# Altium schematic sheet [03]Breakout Headers.SchDoc
size A4; Organization: Altium Limited; Address1: L3, 12a Rodborough Rd; Address2: Frenchs Forest; Address3: NSW; Address4: Australia 2086
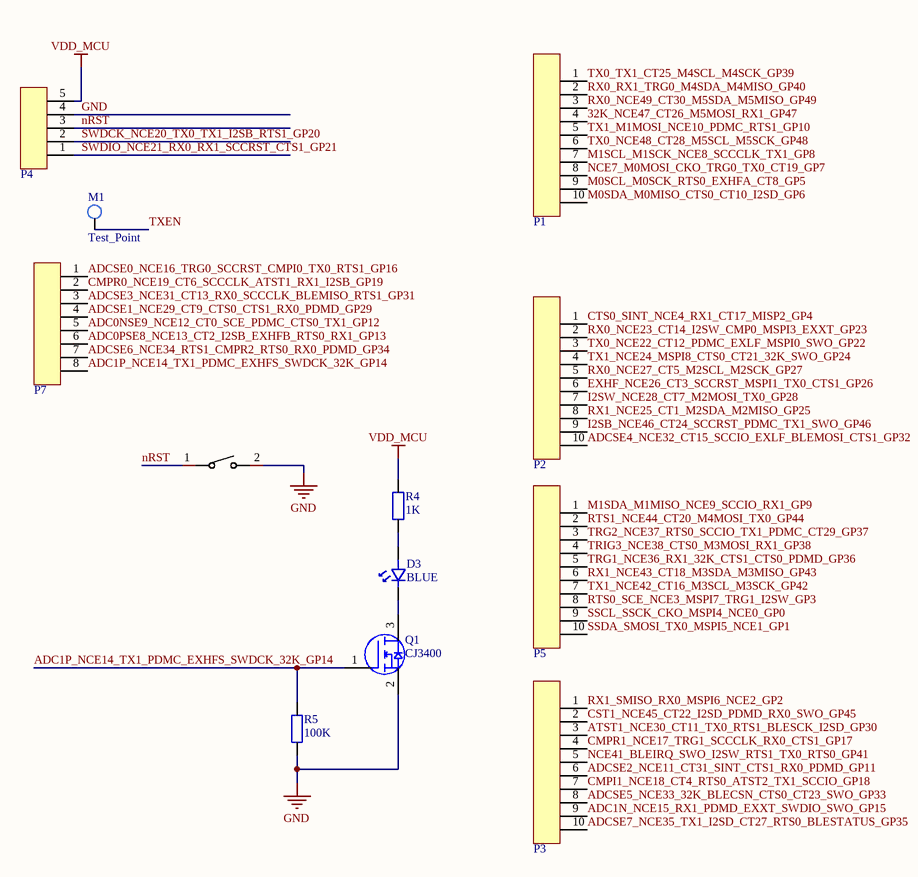
[diagram p0: [03]Breakout Headers.SchDoc]

## Parts
D3  BLUE  [LEDC1608L]
M1  Test_Point  [MARK_Small]
P1  Header 1X10  [HEADER1X10]  (value not drawn)  (no BOM)
P2  Header 1X10  [HEADER1X10]  (value not drawn)  (no BOM)
P3  Header 1X10  [HEADER1X10]  (value not drawn)  (no BOM)
P4  Header 1X8  [HEADER1X5]  (value not drawn)  (no BOM)
P5  Header 1X10  [HEADER1X10]  (value not drawn)  (no BOM)
P7  Header 1X8  [HEADER1X8]  (value not drawn)  (no BOM)
Q1  CJ3400  [SOT23-3L]
R4  1K  [RESC1005L]
R5  100K  [RESC1005L]
SW1  TS-1088-AR02016  [SW-SMD_L4.0-W2.9-LS5.0]  (value not drawn)

## Nets
GND: P4.4 Q1.2 R5.1 SW1.2
VDD_MCU: P4.5 R4.2
32K_NCE47_CT26_M5MOSI_RX1_GP47: P1.4
ADC0NSE9_NCE12_CT0_SCE_PDMC_CTS0_TX1_GP12: P7.5
ADC0PSE8_NCE13_CT2_I2SB_EXHFB_RTS0_RX1_GP13: P7.6
ADC1N_NCE15_RX1_PDMD_EXXT_SWDIO_SWO_GP15: P3.9
ADC1P_NCE14_TX1_PDMC_EXHFS_SWDCK_32K_GP14: P7.8 Q1.1 R5.2
ADCSE0_NCE16_TRG0_SCCRST_CMPI0_TX0_RTS1_GP16: P7.1
ADCSE1_NCE29_CT9_CTS0_CTS1_RX0_PDMD_GP29: P7.4
ADCSE2_NCE11_CT31_SINT_CTS1_RX0_PDMD_GP11: P3.6
ADCSE3_NCE31_CT13_RX0_SCCCLK_BLEMISO_RTS1_GP31: P7.3
ADCSE4_NCE32_CT15_SCCIO_EXLF_BLEMOSI_CTS1_GP32: P2.10
ADCSE5_NCE33_32K_BLECSN_CTS0_CT23_SWO_GP33: P3.8
ADCSE6_NCE34_RTS1_CMPR2_RTS0_RX0_PDMD_GP34: P7.7
ADCSE7_NCE35_TX1_I2SD_CT27_RTS0_BLESTATUS_GP35: P3.10
ATST1_NCE30_CT11_TX0_RTS1_BLESCK_I2SD_GP30: P3.3
CMPI1_NCE18_CT4_RTS0_ATST2_TX1_SCCIO_GP18: P3.7
CMPR0_NCE19_CT6_SCCCLK_ATST1_RX1_I2SB_GP19: P7.2
CMPR1_NCE17_TRG1_SCCCLK_RX0_CTS1_GP17: P3.4
CST1_NCE45_CT22_I2SD_PDMD_RX0_SWO_GP45: P3.2
CTS0_SINT_NCE4_RX1_CT17_MISP2_GP4: P2.1
EXHF_NCE26_CT3_SCCRST_MSPI1_TX0_CTS1_GP26: P2.6
I2SB_NCE46_CT24_SCCRST_PDMC_TX1_SWO_GP46: P2.9
I2SW_NCE28_CT7_M2MOSI_TX0_GP28: P2.7
M0SCL_M0SCK_RTS0_EXHFA_CT8_GP5: P1.9
M0SDA_M0MISO_CTS0_CT10_I2SD_GP6: P1.10
M1SCL_M1SCK_NCE8_SCCCLK_TX1_GP8: P1.7
M1SDA_M1MISO_NCE9_SCCIO_RX1_GP9: P5.1
NCE7_M0MOSI_CKO_TRG0_TX0_CT19_GP7: P1.8
NCE41_BLEIRQ_SWO_I2SW_RTS1_TX0_RTS0_GP41: P3.5
nRST: P4.3 SW1.1
RTS0_SCE_NCE3_MSPI7_TRG1_I2SW_GP3: P5.8
RTS1_NCE44_CT20_M4MOSI_TX0_GP44: P5.2
RX0_NCE23_CT14_I2SW_CMP0_MSPI3_EXXT_GP23: P2.2
RX0_NCE27_CT5_M2SCL_M2SCK_GP27: P2.5
RX0_NCE49_CT30_M5SDA_M5MISO_GP49: P1.3
RX0_RX1_TRG0_M4SDA_M4MISO_GP40: P1.2
RX1_NCE25_CT1_M2SDA_M2MISO_GP25: P2.8
RX1_NCE43_CT18_M3SDA_M3MISO_GP43: P5.6
RX1_SMISO_RX0_MSPI6_NCE2_GP2: P3.1
SSCL_SSCK_CKO_MSPI4_NCE0_GP0: P5.9
SSDA_SMOSI_TX0_MSPI5_NCE1_GP1: P5.10
SWDCK_NCE20_TX0_TX1_I2SB_RTS1_GP20: P4.2
SWDIO_NCE21_RX0_RX1_SCCRST_CTS1_GP21: P4.1
TRG1_NCE36_RX1_32K_CTS1_CTS0_PDMD_GP36: P5.5
TRG2_NCE37_RTS0_SCCIO_TX1_PDMC_CT29_GP37: P5.3
TRIG3_NCE38_CTS0_M3MOSI_RX1_GP38: P5.4
TX0_NCE22_CT12_PDMC_EXLF_MSPI0_SWO_GP22: P2.3
TX0_NCE48_CT28_M5SCL_M5SCK_GP48: P1.6
TX0_TX1_CT25_M4SCL_M4SCK_GP39: P1.1
TX1_M1MOSI_NCE10_PDMC_RTS1_GP10: P1.5
TX1_NCE24_MSPI8_CTS0_CT21_32K_SWO_GP24: P2.4
TX1_NCE42_CT16_M3SCL_M3SCK_GP42: P5.7
TXEN: M1.1
NetD3_1: D3.1 Q1.3
NetD3_2: D3.2 R4.1

## Notes on the sheet
- Title
- Size:
- Date:
- A3
- Number:
- Time:
- Revision:
- Sheet
- of
- File:

## Library data of the parts
D3 = LED_SMD: Surface Mount LED
M1 = Test_Point_Small
P1-P3 P5 = HDR1X10
P4 = HDR1X5
P7 = HDR1X8
Q1 = MOS_N: N-Channel MOSFET
R4 R5 = RES_CHP: Surface Mount Resistor
SW1 = TS-1088-AR02016: Manufacturer: XUNPU(讯普); Add into BOM: yes; Contact Current: 50mA; Voltage Rating (DC): 12V; Insulation Resistance: 100MΩ; Circuit: 单刀单掷; Actuator Style: 圆形按钮; Actuator/Cap Color: 黑色; Operating Force: 160gf@±50gf; Mechanical Life: 100000; Pin Style: SMD接片; Switch Length: 4mm; Switch Width: 3mm; Switch Height: 2mm; Strike Gundam: 否; Name: TS-1088-AR02016; Symbol: TS-1088-AR02016; Device: TS-1088-AR02016; LCSC Part Name: 3x4x2.0 160gf 贴片无柱轻触开关; Supplier Part: C720477; Manufacturer Part: TS-1088-AR02016; Supplier Footprint: SMD; JLCPCB Part Class: Extended Part; Datasheet: https://atta.szlcsc.com/upload/public/pdf/source/20200810/C720475_60D09DD6C54279ADDB2DC25100F1CC11.pdf; Supplier: LCSC; Convert to PCB: yes; Mounting Style: 立贴; Operating Temperature: -30℃~+80℃